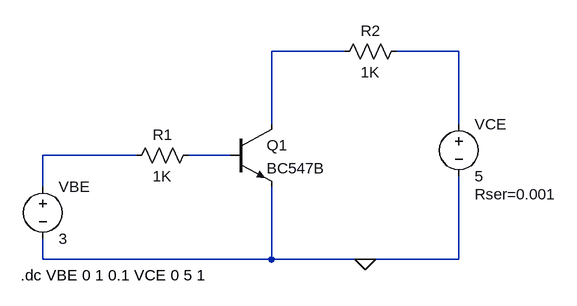
[diagram p0: schematic Exp 4.asc]
Exp 4.asc, the LTspice schematic file:
Version 4
SHEET 1 880 680
WIRE 336 -16 224 -16
WIRE 512 -16 416 -16
WIRE 224 96 224 -16
WIRE 512 96 512 -16
WIRE 16 144 -128 144
WIRE 160 144 96 144
WIRE -128 192 -128 144
WIRE -128 304 -128 272
WIRE 224 304 224 192
WIRE 224 304 -128 304
WIRE 368 304 224 304
WIRE 512 304 512 176
WIRE 512 304 368 304
FLAG 368 304 0
SYMBOL npn 160 96 R0
SYMATTR InstName Q1
SYMATTR Value BC547B
SYMBOL voltage 512 80 R0
WINDOW 123 0 0 Left 0
WINDOW 39 24 124 Left 2
SYMATTR InstName VCE
SYMATTR Value 5
SYMATTR SpiceLine Rser=0.001
SYMBOL voltage -128 176 R0
SYMATTR InstName VBE
SYMATTR Value 3
SYMBOL res 112 128 R90
WINDOW 0 0 56 VBottom 2
WINDOW 3 32 56 VTop 2
SYMATTR InstName R1
SYMATTR Value 1K
SYMBOL res 432 -32 R90
WINDOW 0 0 56 VBottom 2
WINDOW 3 32 56 VTop 2
SYMATTR InstName R2
SYMATTR Value 1K
TEXT -162 328 Left 2 !.dc VBE 0 1 0.1 VCE 0 5 1

The netlist it stands for:
* Exp 4.asc
Q1 N001 N004 0 0 BC547B
VCE N002 0 5 Rser=0.001
VBE N003 0 3
R1 N004 N003 1K
R2 N002 N001 1K
.model NPN NPN
.model PNP PNP
.lib standard.bjt
.dc VBE 0 1 0.1 VCE 0 5 1
.backanno
.end